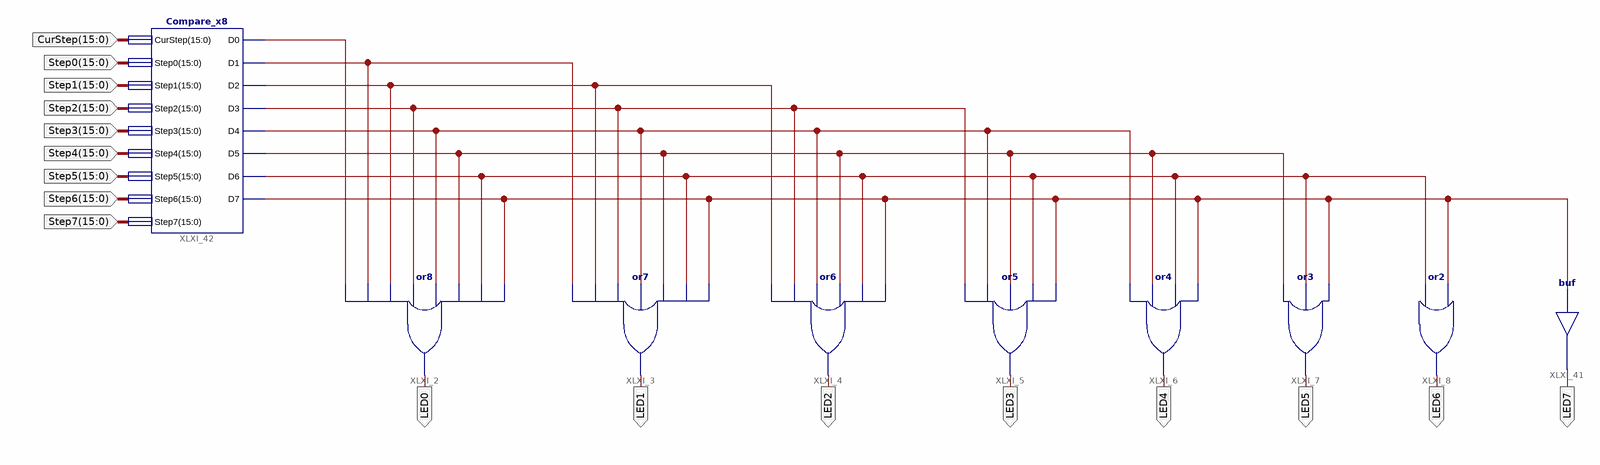
[diagram p0: schematic sheet 1]
// Xilinx ISE schematic LED_ProgressBar.sch (spartan6) as structural Verilog: 9 symbols, 17 ports
module LED_ProgressBar (
  input  [15:0] CurStep,
  input  [15:0] Step0,
  input  [15:0] Step1,
  input  [15:0] Step2,
  input  [15:0] Step3,
  input  [15:0] Step4,
  input  [15:0] Step5,
  input  [15:0] Step6,
  input  [15:0] Step7,
  output LED0,
  output LED2,
  output LED1,
  output LED3,
  output LED5,
  output LED6,
  output LED4,
  output LED7
);

  wire A0, A1, A2, A3, A4, A5, A6, A7;

  or XLXI_2 (LED0, A0, A1, A2, A3, A4, A5, A6, A7);
  or XLXI_4 (LED2, A2, A3, A4, A5, A6, A7);
  or XLXI_3 (LED1, A1, A2, A3, A4, A5, A6, A7);
  or XLXI_5 (LED3, A3, A4, A5, A6, A7);
  or XLXI_7 (LED5, A5, A6, A7);
  or XLXI_8 (LED6, A6, A7);
  or XLXI_6 (LED4, A4, A5, A6, A7);
  buf XLXI_41 (LED7, A7);
  Compare_x8 XLXI_42 (
    .CurStep(CurStep), .Step0(Step0), .Step1(Step1), .Step2(Step2), .Step3(Step3), .Step4(Step4),
    .Step5(Step5), .Step6(Step6), .Step7(Step7), .D0(A0), .D1(A1), .D2(A2), .D3(A3), .D4(A4), .D5(A5),
    .D6(A6), .D7(A7));
endmodule
